# EAGLE design ButtonBoard (EAGLE 6.1)
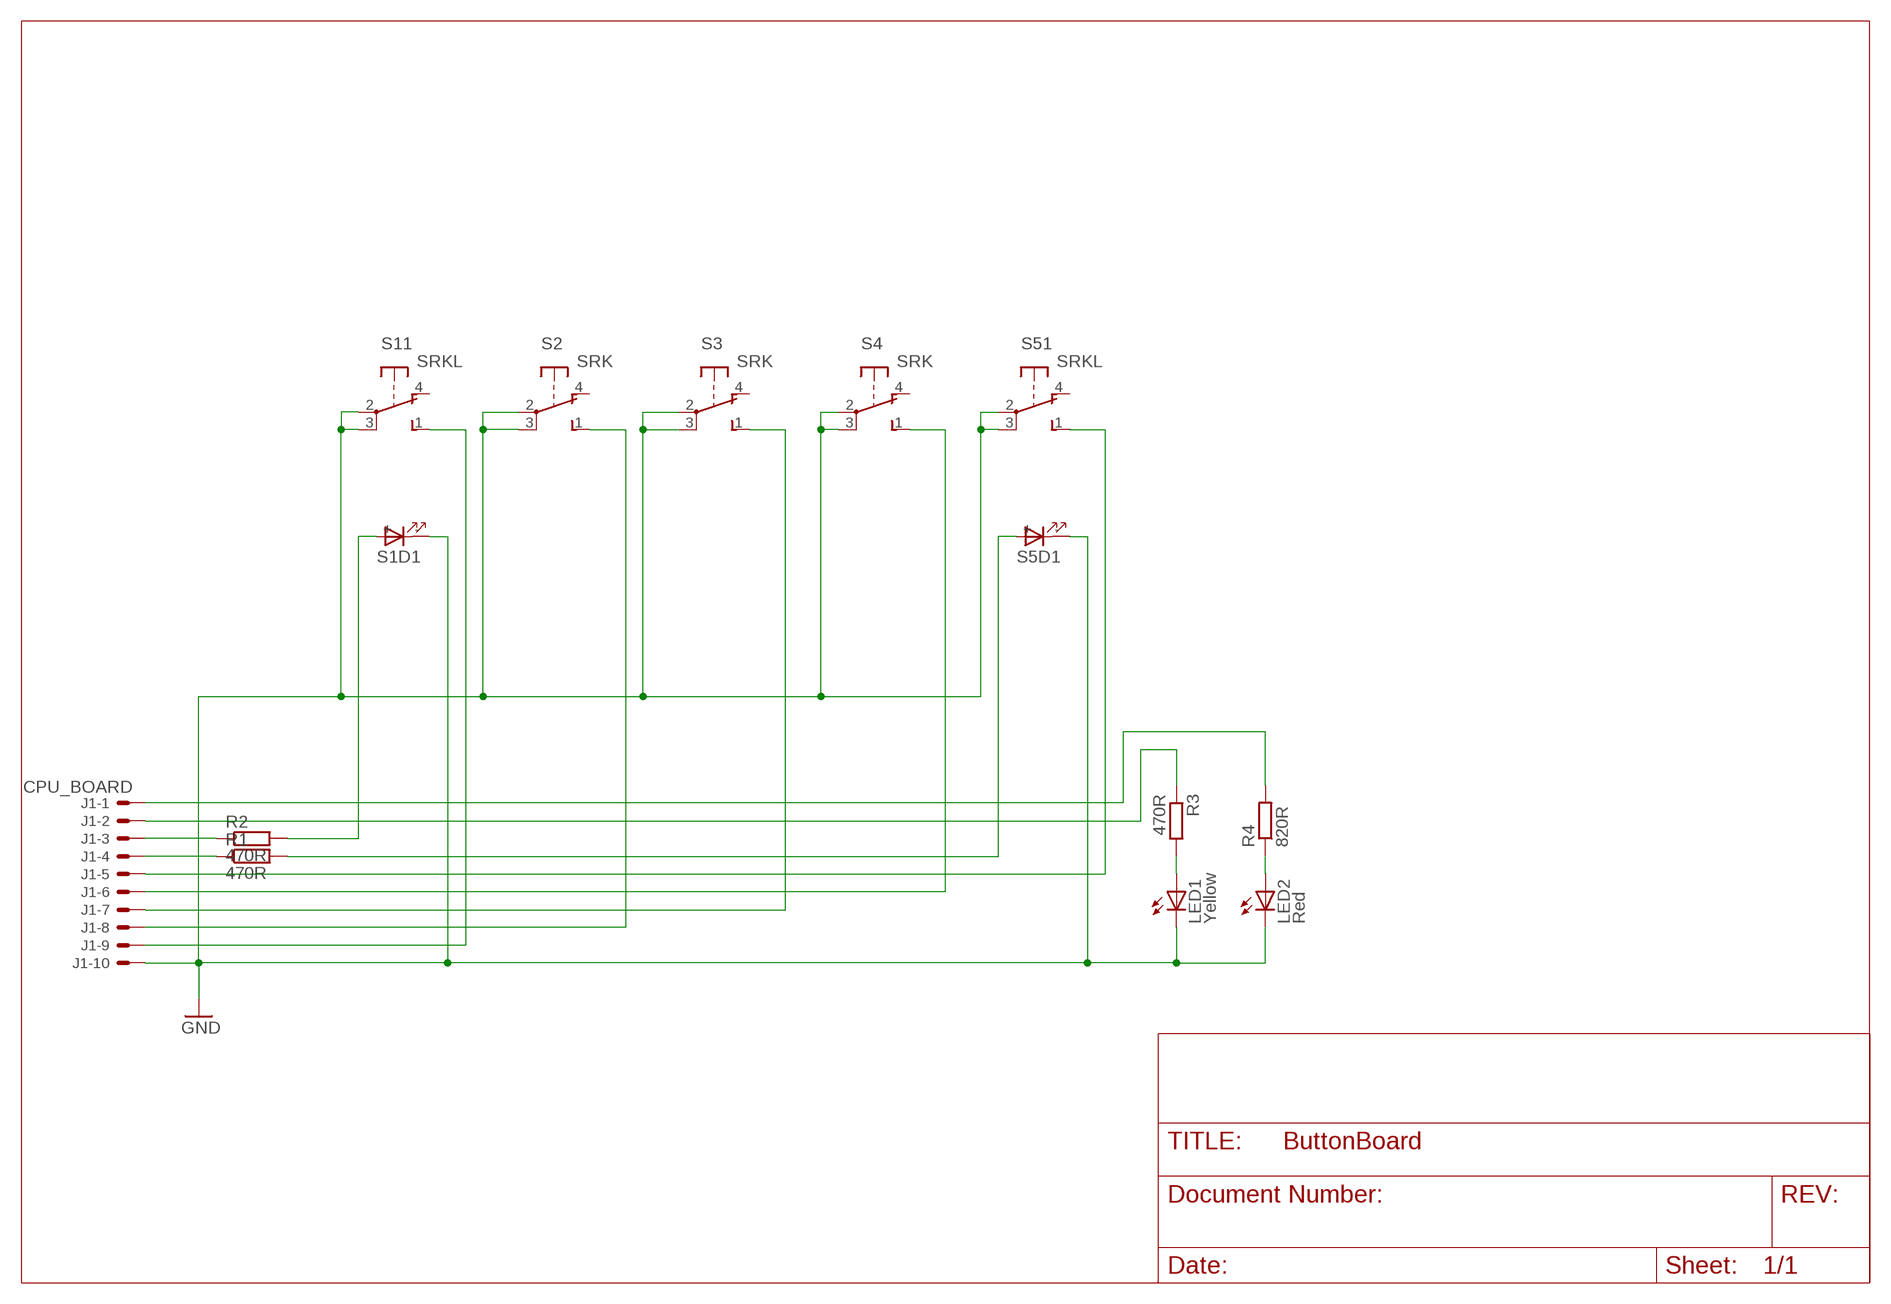
[diagram p0: schematic, sheet 1]

## Parts
J1  CPU_BOARD  22-05-7108-10  [7395-10]
LED1  Yellow  LED3MM  [LED3MM]
LED2  Red  LED3MM  [LED3MM]
R1  470R  R-EU_0207/10  [0207/10]
R2  470R  R-EU_0207/10  [0207/10]
R3  470R  R-EU_0207/10  [0207/10]
R4  820R  R-EU_0207/10  [0207/10]
S1  SRKL  [SRKL]
S2  SRK  [SRK]
S3  SRK  [SRK]
S4  SRK  [SRK]
S5  SRKL  [SRKL]

## Nets
GND: J1.10 LED1.K(C) LED2.K(C) S1.2(1:P) S1.3(1:P) S1.-(D1:C) S2.2(P) S2.3(P) S3.2(P) S3.3(P) S4.2(P) S4.3(P) S5.2(1:P) S5.3(1:P) S5.-(D1:C)
N$1: R2.2 S1.+(D1:A)
N$2: J1.3 R2.1
N$3: J1.4 R1.1
N$4: J1.9 S1.1(1:S)
N$5: R1.2 S5.+(D1:A)
N$6: J1.8 S2.1(S)
N$7: J1.7 S3.1(S)
N$8: J1.6 S4.1(S)
N$9: J1.5 S5.1(1:S)
N$11: LED2.A R4.1
N$12: LED1.A R3.2
N$13: J1.2 R3.1
N$14: J1.1 R4.2
Unconnected: S1.4(1:O) S2.4(O) S3.4(O) S4.4(O) S5.4(1:O)

## Library data of the parts
J1 = con-molex:22-?-10: CONNECTOR wire to board 2.54 mm (.1 inch) pitch header; OC_FARNELL: unknown; OC_NEWARK: unknown
LED1 LED2 = led:LED: LED OSRAM: - CHIPLED LG R971, LG N971, LY N971, LG Q971, LY Q971, LO R971, LY R971 LH N974, LH R974 LS Q976, LO Q976, LY Q976 LO Q996 - Hyper CHIPLED LW Q18S LB Q993, LB Q99A, LB R99A - SideLED LS A670, LO A670, LY A670, LG A670, LP A670 LB A673, LV A673, LT A673, LW A673 LH A674 LY A675 LS A676, LA A676, LO A676, LY A676, LW A676 LS A679, LY A679, LG A679 - Hyper Micro SIDELED® LS Y876, LA Y876, LO Y876, LY Y876 LT Y87S - SmartLED LW L88C, LW L88S LB L89C, LB L89S, LG L890 LS L89K, LO L89K, LY L89K LS L896, LA L896, LO L896, LY L896 - TOPLED LS T670, LO T670, LY T670, LG T670, LP T670 LSG T670, LSP T670, LSY T670, LOP T670, LYG T670 LG T671, LOG T671, LSG T671 LB T673, LV T673, LT T673, LW T673 LH T674 LS T676, LA T676, LO T676, LY T676, LB T676, LH T676, LSB T676, LW T676 LB T67C, LV T67C, LT T67C, LS T67K, LO T67K, LY T67K, LW E67C LS E67B, LA E67B, LO E67B, LY E67B, LB E67C, LV E67C, LT E67C LW T67C LS T679, LY T679, LG T679 LS T770, LO T770, LY T770, LG T770, LP T770 LB T773, LV T773, LT T773, LW T773 LH T774 LS E675, LA E675, LY E675, LS T675 LS T776, LA T776, LO T776, LY T776, LB T776 LHGB T686 LT T68C, LB T68C - Hyper Mini TOPLED® LB M676 - Mini TOPLED Santana® LG M470 LS M47K, LO M47K, LY M47K Source: http://www.osram.convergy.de LUXEON: - LUMILED® LXK2-PW12-R00, LXK2-PW12-S00, LXK2-PW14-U00, LXK2-PW14-V00 LXK2-PM12-R00, LXK2-PM12-S00, LXK2-PM14-U00 LXK2-PE12-Q00, LXK2-PE12-R00, LXK2-PE12-S00, LXK2-PE14-T00, LXK2-PE14-U00 LXK2-PB12-K00, LXK2-PB12-L00, LXK2-PB12-M00, LXK2-PB14-N00, LXK2-PB14-P00, LXK2-PB14-Q00 LXK2-PR12-L00, LXK2-PR12-M00, LXK2-PR14-Q00, LXK2-PR14-R00 LXK2-PD12-Q00, LXK2-PD12-R00, LXK2-PD12-S00 LXK2-PH12-R00, LXK2-PH12-S00 LXK2-PL12-P00, LXK2-PL12-Q00, LXK2-PL12-R00 Source: www.luxeon.com KINGBRIGHT: KA-3528ASYC Source: www.kingbright.com
R1-R4 = rcl:R-EU_: RESISTOR, European symbol
S1 S5 = switch-misc:SRKL: SWITCH
S2-S4 = switch-misc:SRK: SWITCH

## Board
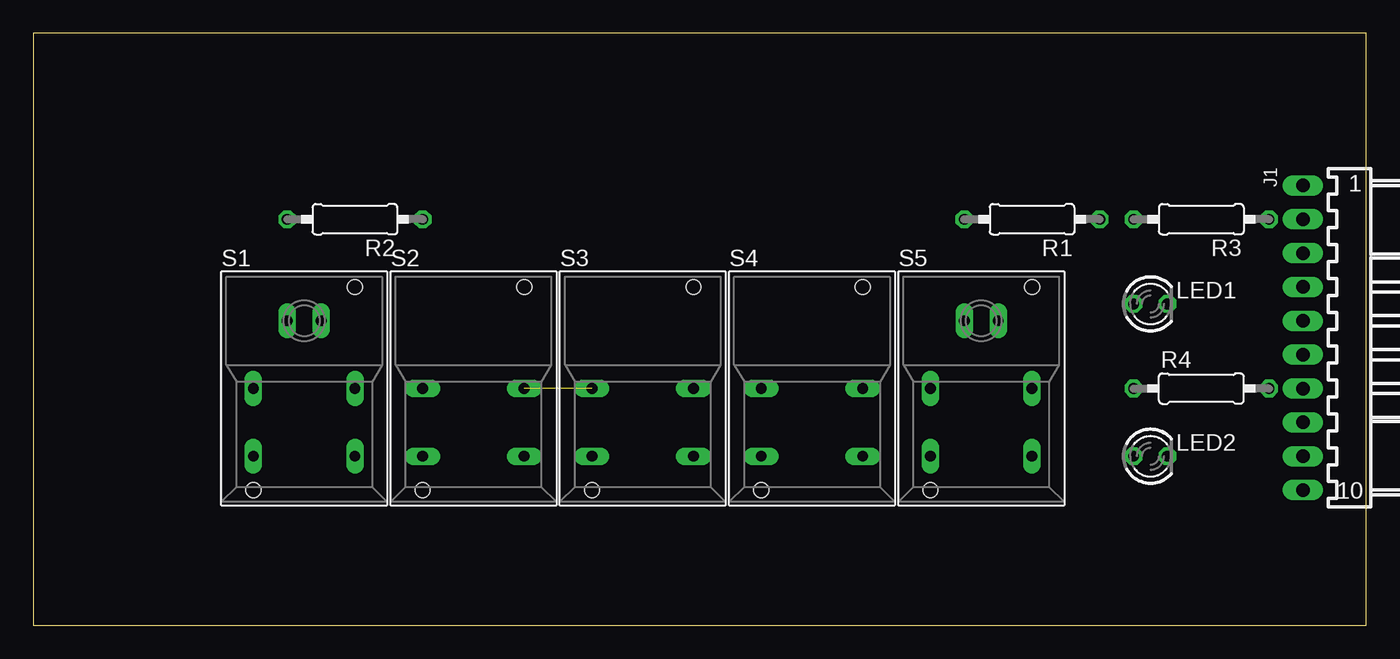
[diagram p1: board, top side]
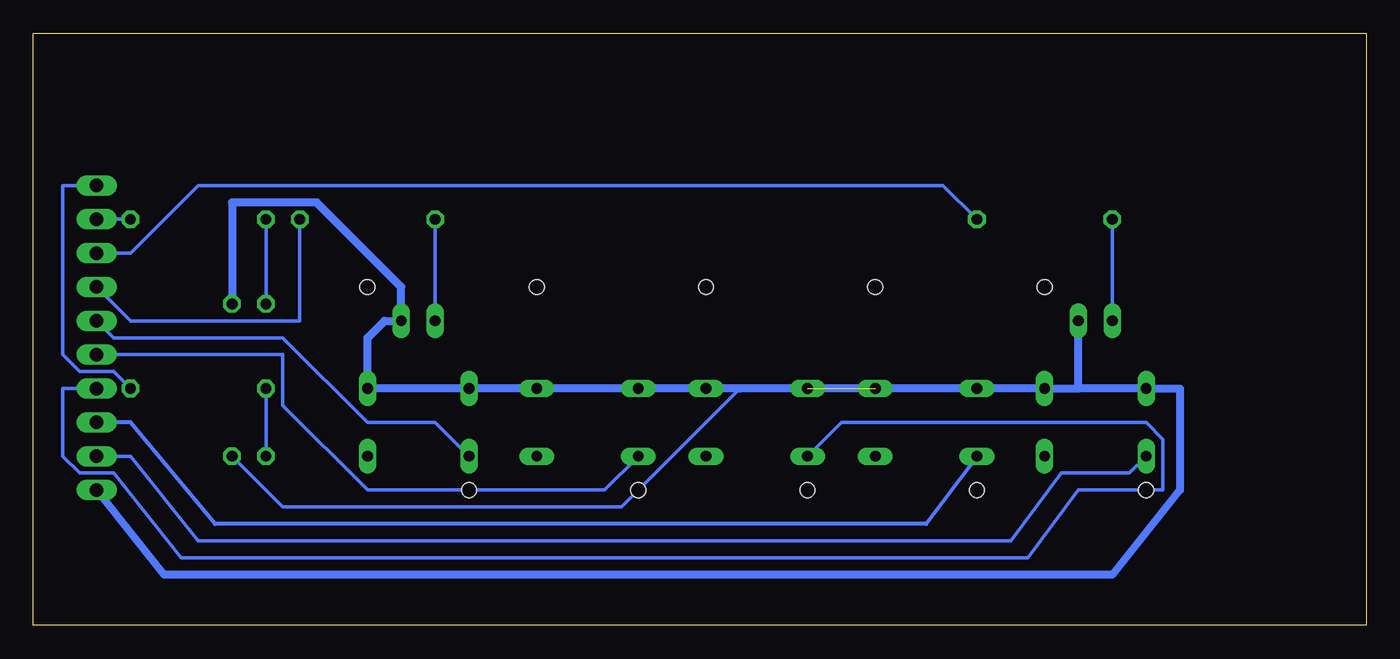
[diagram p2: board, bottom side, seen from below]

Size 100 x 44.44 mm. Coordinates in mm from the lower left corner, seen from the top.
Outline: 0,0 100,0 100,44.44 0,44.44 0,0
Copper layers (1*16): Top 0.035mm / dielectric 1.5mm / Bottom 0.035mm
Design rules: minimum track width 10mil, minimum drill 24mil, track to track 8mil, track to pad 8mil, pad to pad 8mil, via to via 8mil, smd to smd 8mil, copper to edge 40mil, drill to drill 8mil, minimum pad ring 10mil, minimum via ring 8mil, stop-mask expansion 4mil, vias tented up to drill 0mil, thermal gap 10mil

### Footprints (pad centres in the part's own frame; a part is rotated, then mirrored left to right if it is on the bottom)
7395-10 = drill 1.016 long: 1 11.43,0; 2 8.89,0; 3 6.35,0; 4 3.81,0; 5 1.27,0; 6 -1.27,0; 7 -3.81,0; 8 -6.35,0; 9 -8.89,0; 10 -11.43,0
LED3MM = drill 0.813 octagon: A -1.27,0; K 1.27,0
0207/10 = drill 0.813 octagon: 1 -5.08,0; 2 5.08,0
SRKL = drill 0.813 long: 1 -3.81,-5.08; 2 -3.81,0; 3 3.81,0; 4 3.81,-5.08; + -1.27,5.08; - 1.27,5.08 | hole 1.118: 3.81,7.62; -3.81,-7.62
SRK = drill 0.813 long: 1 -3.81,-5.08; 2 -3.81,0; 3 3.81,0; 4 3.81,-5.08 | hole 1.118: -3.81,-7.62; 3.81,7.62

### Placement (x,y rotation side)
J1  95.25,21.59 90 top
LED1  83.82,24.13 0 top
LED2  83.82,12.7 0 top
R1  74.93,30.48 180 top
R2  24.13,30.48 180 top
R3  87.63,30.48 180 top
R4  87.63,17.78 0 top
S1  20.32,17.78 0 top
S2  33.02,17.78 0 top
S3  45.72,17.78 0 top
S4  58.42,17.78 0 top
S5  71.12,17.78 0 top

### Tracks (layer width: path | path; a pad name or v marks a point on that pad's centre or on a via)
GND  (1 unrouted)
  Bottom 0.254: LED2.K 81.28,8.89 55.88,8.89 46.99,17.78
  Bottom 0.61: LED1.K 85.09,31.75 78.74,31.75 72.39,25.4 S5.- 73.66,22.86 74.93,21.59 S5.3 S5.2 S4.3 S4.2 S3.3 46.99,17.78 S3.2 S1.3 | 21.59,17.78 S1.- | S1.3 21.59,17.78 | J1.10 90.17,3.81 19.05,3.81 13.97,10.16 13.97,17.78 S1.2 21.59,17.78 | S1.3 S2.2
N$1
  Bottom 0.254: R2.2 S1.+
N$2
  Bottom 0.254: R2.1 31.75,33.02 87.63,33.02 92.71,27.94 J1.3
N$3
  Bottom 0.254: R1.1 80.01,22.86 92.71,22.86 J1.4
N$4
  Bottom 0.254: S1.1 17.78,11.43 22.86,11.43 26.67,6.35 87.63,6.35 92.71,12.7 J1.9
N$5
  Bottom 0.254: R1.2 S5.+
N$6
  Bottom 0.305: S2.1 33.02,7.62 86.36,7.62 92.71,15.24 J1.8
N$7
  Bottom 0.254: S3.1 39.37,15.24 16.51,15.24 15.24,13.97 15.24,10.16 21.59,10.16 25.4,5.08 88.9,5.08 93.98,11.43 96.52,11.43 97.79,12.7 97.79,17.78 J1.7
N$8
  Bottom 0.254: S4.1 57.15,10.16 74.93,10.16 81.28,16.51 81.28,20.32 J1.6
N$9
  Bottom 0.254: S5.1 69.85,15.24 74.93,15.24 81.28,21.59 93.98,21.59 J1.5
N$11
  Bottom 0.254: R4.1 LED2.A
N$12
  Bottom 0.254: R3.2 LED1.A
N$13
  Bottom 0.254: J1.2 R3.1
N$14
  Bottom 0.254: R4.2 93.98,19.05 96.52,19.05 97.79,20.32 97.79,33.02 J1.1